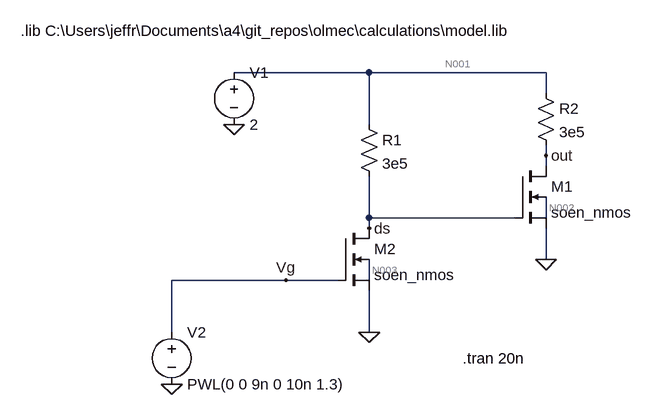
[diagram p0: schematic nmos_inverter.asc]
nmos_inverter.asc, the LTspice schematic file:
Version 4
SHEET 1 2744 1332
WIRE 112 -400 -96 -400
WIRE 384 -400 112 -400
WIRE 384 -368 384 -400
WIRE 112 -320 112 -400
WIRE 384 -272 384 -288
WIRE 384 -256 384 -272
WIRE 112 -176 112 -240
WIRE 336 -176 112 -176
WIRE 384 -176 384 -208
WIRE 112 -160 112 -176
WIRE 384 -112 384 -160
WIRE -16 -80 -192 -80
WIRE 64 -80 -16 -80
WIRE 112 -80 112 -112
WIRE -192 0 -192 -80
WIRE 112 0 112 -64
FLAG -96 -320 0
FLAG -192 80 0
FLAG 112 0 0
FLAG 112 -160 ds
FLAG -16 -80 Vg
FLAG 384 -112 0
FLAG 384 -272 out
SYMBOL voltage -96 -416 R0
WINDOW 123 0 0 Left 0
WINDOW 39 0 0 Left 0
SYMATTR InstName V1
SYMATTR Value 2
SYMBOL voltage -192 -16 R0
WINDOW 123 0 0 Left 0
WINDOW 39 0 0 Left 0
SYMATTR InstName V2
SYMATTR Value PWL(0 0 9n 0 10n 1.3)
SYMBOL res 96 -336 R0
SYMATTR InstName R1
SYMATTR Value 3e5
SYMBOL nmos4 64 -160 R0
SYMATTR InstName M2
SYMATTR Value soen_nmos
SYMATTR Value2 l=1u w=10u
SYMBOL nmos4 336 -256 R0
SYMATTR InstName M1
SYMATTR Value soen_nmos
SYMATTR Value2 l=1u w=10u
SYMBOL res 368 -384 R0
SYMATTR InstName R2
SYMATTR Value 3e5
TEXT 256 40 Left 2 !.tran 20n
TEXT -424 -464 Left 2 !.lib C:\\Users\\jeffr\\Documents\\a4\\git_repos\\olmec\\calculations\\model.lib

The netlist it stands for:
* nmos_inverter.asc
V1 N001 0 2
V2 Vg 0 PWL(0 0 9n 0 10n 1.3)
R1 N001 ds 3e5
M2 ds Vg 0 N003 soen_nmos l=1u w=10u
M1 out ds 0 N002 soen_nmos l=1u w=10u
R2 N001 out 3e5
.model NMOS NMOS
.model PMOS PMOS
.lib standard.mos
.tran 20n
.lib C:\Users\jeffr\Documents\a4\git_repos\olmec\calculations\model.lib
.backanno
.end

* Results of the author's LTspice run, read from the files saved beside the schematic
* Operating Point, zero values left out:
*   V(n001) = 2 V
*   V(ds) = 2 V
*   V(n003) = 131.7 mV
*   V(out) = 57.65 mV
*   V(n002) = 18.37 mV
*   Id(M1) = 6.474 µA
*   Is(M1) = -6.474 µA
*   Id(M2) = 3.878 pA
*   Is(M2) = -3.747 pA
*   I(R2) = 6.474 µA
*   I(R1) = 3.878 pA
*   I(V1) = -6.475 µA
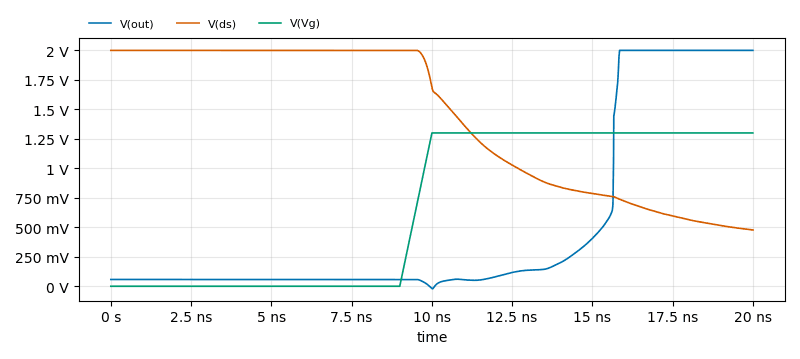
[diagram p1: Transient Analysis of nmos_inverter.asc, plotted from the saved traces]
* Transient Analysis, 1 run:
*   V(out): min -21.39 mV, max 2 V, average 509.4 mV, rms 935 mV, last 2 V
*   V(ds): min 477.4 mV, max 2 V, average 1.425 V, rms 1.551 V, last 477.4 mV
*   V(Vg): min 0 V, max 1.3 V, average 682.5 mV, rms 934.4 mV, last 1.3 V